# Altium schematic sheet PLD_Sail_interface.SchDoc: Latch Indicator Interface for Sail
size A4; SheetTotal: 32
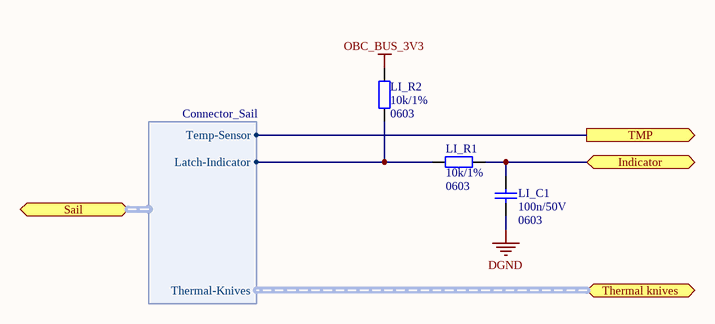
[diagram p0: PLD_Sail_interface.SchDoc]

## Parts
LI_C1  Package: 0603  [SMD_Capacitor_0603]  (hidden comment: 100n/50V)
LI_R1  Package: 0603  [SMD_Resistor_0603]  (hidden comment: 10k/1%)
LI_R2  Package: 0603  [SMD_Resistor_0603]  (hidden comment: 10k/1%)

## Ports
Indicator, Sail (harness Connector_Sail), Thermal knives (harness Sail_Thermal-Knives), TMP (out)

## Harnesses
Connector_Sail: Latch-Indicator, Temp-Sensor, Thermal-Knives

## Nets
DGND: LI_C1.1
OBC_BUS_3V3: LI_R2.1
Indicator: LI_C1.2 LI_R1.2 ; port Indicator
TMP: port TMP, port Sail.Temp-Sensor
NetLI_R1_1: LI_R1.1 LI_R2.2 ; port Sail.Latch-Indicator

## Notes on the sheet
- Title:
- Project:
- Author:
- Model:
- Document Number:
- Checked by:
- Rev:
- Date:
- Approved by:
- Sheet:
- of
- File name:

## Library data of the parts
LI_C1 = Cer_C0603T104K5RALTU: Ceramic Cap Kemet COTS 100n/50V X7R 0603; Manufacturer: Kemet; ManufacturerPartNumber: C0603T104K5RALTU; Value: 100n/50V
LI_R1 LI_R2 = CRCW060310K0FKxxxx: 10k/1% Vishay CRCW 0603 Resistor. 100mW, 100ppm, 75V.; Manufacturer: Vishay; ManufacturerPartNumber: CRCW060310K0FKxxxx; Value: 10k/1%